# EAGLE design t-maze-shield (EAGLE 6.2)
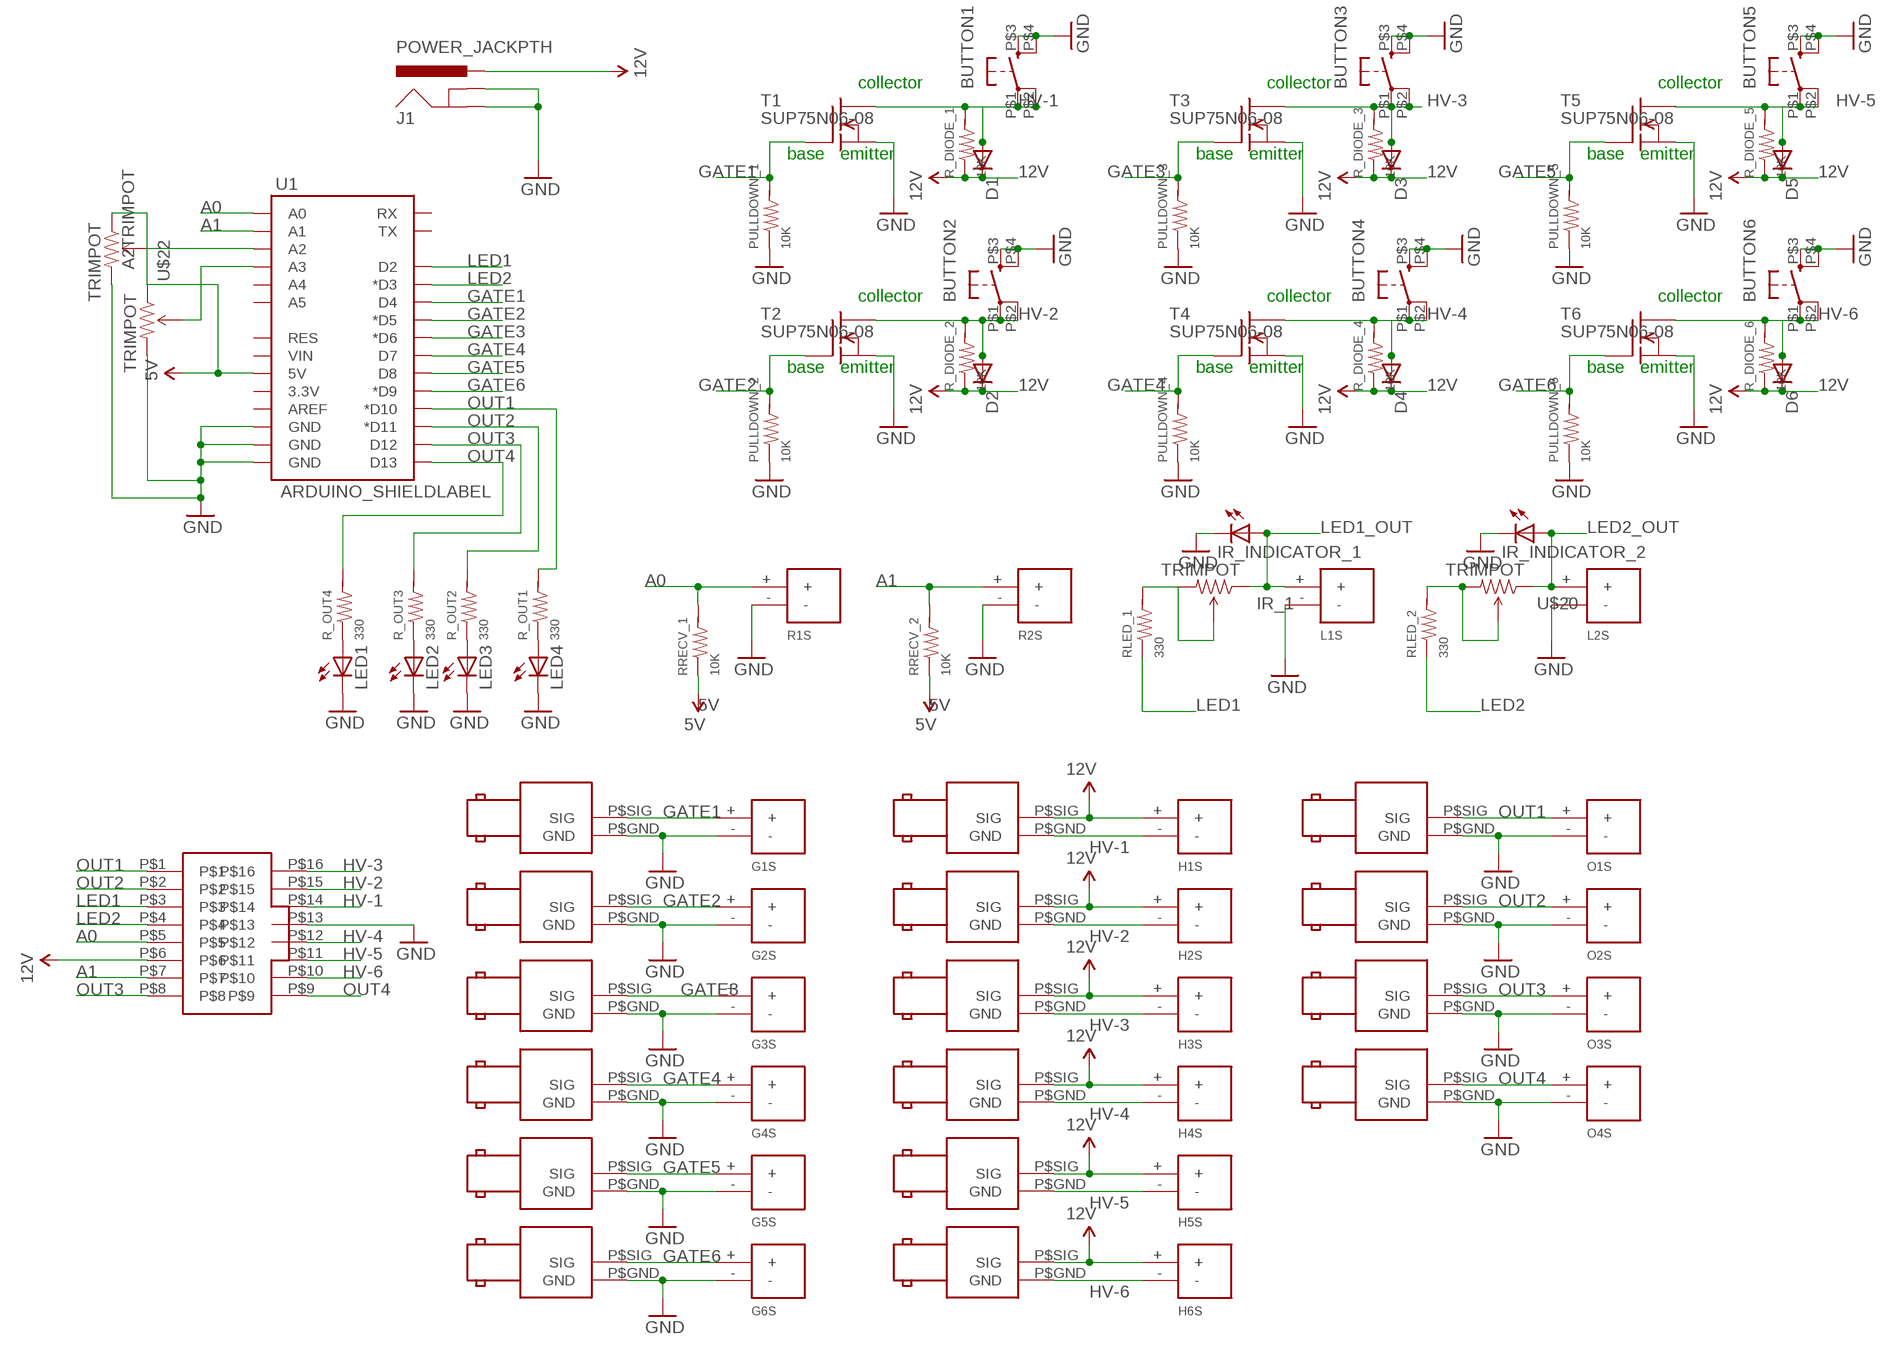
[diagram p0: schematic, sheet 1]

## Parts
A2TRIMPOT  TRIMPOT  [3362U-2]
BUTTON1  TAC_SWITCHKSA_SEALED  [KSA_SEALED_TAC_SWITCH]
BUTTON2  TAC_SWITCHKSA_SEALED  [KSA_SEALED_TAC_SWITCH]
BUTTON3  TAC_SWITCHKSA_SEALED  [KSA_SEALED_TAC_SWITCH]
BUTTON4  TAC_SWITCHKSA_SEALED  [KSA_SEALED_TAC_SWITCH]
BUTTON5  TAC_SWITCHKSA_SEALED  [KSA_SEALED_TAC_SWITCH]
BUTTON6  TAC_SWITCHKSA_SEALED  [KSA_SEALED_TAC_SWITCH]
D1  DIODE1N4148  [DIODE-1N4148]
D2  DIODE1N4148  [DIODE-1N4148]
D3  DIODE1N4148  [DIODE-1N4148]
D4  DIODE1N4148  [DIODE-1N4148]
D5  DIODE1N4148  [DIODE-1N4148]
D6  DIODE1N4148  [DIODE-1N4148]
G1S  SCREW_TERM_2  [SCREW_TERM]
G2S  SCREW_TERM_2  [SCREW_TERM]
G3S  SCREW_TERM_2  [SCREW_TERM]
G4S  SCREW_TERM_2  [SCREW_TERM]
G5S  SCREW_TERM_2  [SCREW_TERM]
G6S  SCREW_TERM_2  [SCREW_TERM]
GATE1  BNC_RIGHT_ANGLE  [BNC_RIGHT_ANGLE]
GATE2  BNC_RIGHT_ANGLE  [BNC_RIGHT_ANGLE]
GATE3  BNC_RIGHT_ANGLE  [BNC_RIGHT_ANGLE]
GATE4  BNC_RIGHT_ANGLE  [BNC_RIGHT_ANGLE]
GATE5  BNC_RIGHT_ANGLE  [BNC_RIGHT_ANGLE]
GATE6  BNC_RIGHT_ANGLE  [BNC_RIGHT_ANGLE]
H1S  SCREW_TERM_2  [SCREW_TERM]
H2S  SCREW_TERM_2  [SCREW_TERM]
H3S  SCREW_TERM_2  [SCREW_TERM]
H4S  SCREW_TERM_2  [SCREW_TERM]
H5S  SCREW_TERM_2  [SCREW_TERM]
H6S  SCREW_TERM_2  [SCREW_TERM]
I/O1  BNC_RIGHT_ANGLE  [BNC_RIGHT_ANGLE]
I/O2  BNC_RIGHT_ANGLE  [BNC_RIGHT_ANGLE]
I/O3  BNC_RIGHT_ANGLE  [BNC_RIGHT_ANGLE]
I/O4  BNC_RIGHT_ANGLE  [BNC_RIGHT_ANGLE]
IDC-16  IDC_16PIN  [IDC_16PIN]
IR_1  TRIMPOT  [3362U-2]
IR_INDICATOR_1  LED5MM  [LED5MM]
IR_INDICATOR_2  LED5MM  [LED5MM]
J1  POWER_JACKPTH  [POWER_JACK_PTH]
L1S  SCREW_TERM_2  [SCREW_TERM]
L2S  SCREW_TERM_2  [SCREW_TERM]
LED1  LED5MM  [LED5MM]
LED2  LED5MM  [LED5MM]
LED3  LED5MM  [LED5MM]
LED4  LED5MM  [LED5MM]
O1S  SCREW_TERM_2  [SCREW_TERM]
O2S  SCREW_TERM_2  [SCREW_TERM]
O3S  SCREW_TERM_2  [SCREW_TERM]
O4S  SCREW_TERM_2  [SCREW_TERM]
OUT1  BNC_RIGHT_ANGLE  [BNC_RIGHT_ANGLE]
OUT2  BNC_RIGHT_ANGLE  [BNC_RIGHT_ANGLE]
OUT3  BNC_RIGHT_ANGLE  [BNC_RIGHT_ANGLE]
OUT4  BNC_RIGHT_ANGLE  [BNC_RIGHT_ANGLE]
OUT5  BNC_RIGHT_ANGLE  [BNC_RIGHT_ANGLE]
OUT6  BNC_RIGHT_ANGLE  [BNC_RIGHT_ANGLE]
PULLDOWN_1  10K  RESISTOR_PTH  [RESISTOR_PTH]
PULLDOWN_2  10K  RESISTOR_PTH  [RESISTOR_PTH]
PULLDOWN_3  10K  RESISTOR_PTH  [RESISTOR_PTH]
PULLDOWN_4  10K  RESISTOR_PTH  [RESISTOR_PTH]
PULLDOWN_5  10K  RESISTOR_PTH  [RESISTOR_PTH]
PULLDOWN_6  10K  RESISTOR_PTH  [RESISTOR_PTH]
R1S  SCREW_TERM_2  [SCREW_TERM]
R2S  SCREW_TERM_2  [SCREW_TERM]
R_DIODE_1  10K  RESISTOR_PTH  [RESISTOR_PTH]
R_DIODE_2  10K  RESISTOR_PTH  [RESISTOR_PTH]
R_DIODE_3  10K  RESISTOR_PTH  [RESISTOR_PTH]
R_DIODE_4  10K  RESISTOR_PTH  [RESISTOR_PTH]
R_DIODE_5  10K  RESISTOR_PTH  [RESISTOR_PTH]
R_DIODE_6  10K  RESISTOR_PTH  [RESISTOR_PTH]
R_OUT1  330  RESISTOR_PTH  [RESISTOR_PTH]
R_OUT2  330  RESISTOR_PTH  [RESISTOR_PTH]
R_OUT3  330  RESISTOR_PTH  [RESISTOR_PTH]
R_OUT4  330  RESISTOR_PTH  [RESISTOR_PTH]
RLED_1  330  RESISTOR_PTH  [RESISTOR_PTH]
RLED_2  330  RESISTOR_PTH  [RESISTOR_PTH]
RRECV_1  10K  RESISTOR_PTH  [RESISTOR_PTH]
RRECV_2  10K  RESISTOR_PTH  [RESISTOR_PTH]
T1  SUP75N06-08  [TO220]
T2  SUP75N06-08  [TO220]
T3  SUP75N06-08  [TO220]
T4  SUP75N06-08  [TO220]
T5  SUP75N06-08  [TO220]
T6  SUP75N06-08  [TO220]
U1  ARDUINO_SHIELDLABEL  [DUEMILANOVE_SHIELD]
U$20  TRIMPOT  [3362U-2]
U$22  TRIMPOT  [3362U-2]

## Nets
5V: A2TRIMPOT.1(CCW) RRECV_1.P$1 RRECV_2.P$1 U1.5V U$22.1(CCW)
12V: D1.C D2.C D3.C D4.C D5.C D6.C H1S.+ H2S.+ H3S.+ H4S.+ H5S.+ H6S.+ IDC-16.P$6 J1.PWR OUT1.P$SIG(SIG) OUT2.P$SIG(SIG) OUT3.P$SIG(SIG) OUT4.P$SIG(SIG) OUT5.P$SIG(SIG) OUT6.P$SIG(SIG) R_DIODE_1.P$1 R_DIODE_2.P$1 R_DIODE_3.P$1 R_DIODE_4.P$1 R_DIODE_5.P$1 R_DIODE_6.P$1
A0: IDC-16.P$5 R1S.+ RRECV_1.P$2 U1.A0
A1: IDC-16.P$7 R2S.+ RRECV_2.P$2 U1.A1
A3TRIMPOT: U1.A3 U$22.2(WIPER)
GATE1: G1S.+ GATE1.P$SIG(SIG) PULLDOWN_1.P$2 T1.1(G) U1.D4
GATE2: G2S.+ GATE2.P$SIG(SIG) PULLDOWN_2.P$2 T2.1(G) U1.D5(*D5)
GATE3: G3S.+ GATE3.P$SIG(SIG) PULLDOWN_3.P$2 T3.1(G) U1.D6(*D6)
GATE4: G4S.+ GATE4.P$SIG(SIG) PULLDOWN_4.P$2 T4.1(G) U1.D7
GATE5: G5S.+ GATE5.P$SIG(SIG) PULLDOWN_5.P$2 T5.1(G) U1.D8
GATE6: G6S.+ GATE6.P$SIG(SIG) PULLDOWN_6.P$2 T6.1(G) U1.D9(*D9)
GND: A2TRIMPOT.3(CW) BUTTON1.P$3 BUTTON1.P$4 BUTTON2.P$3 BUTTON2.P$4 BUTTON3.P$3 BUTTON3.P$4 BUTTON4.P$3 BUTTON4.P$4 BUTTON5.P$3 BUTTON5.P$4 BUTTON6.P$3 BUTTON6.P$4 G1S.- G2S.- G3S.- G4S.- G5S.- G6S.- GATE1.P$GND(GND) GATE2.P$GND(GND) GATE3.P$GND(GND) GATE4.P$GND(GND) GATE5.P$GND(GND) GATE6.P$GND(GND) I/O1.P$GND(GND) I/O2.P$GND(GND) I/O3.P$GND(GND) I/O4.P$GND(GND) IDC-16.P$13 IR_INDICATOR_1.K(C) IR_INDICATOR_2.K(C) J1.GND J1.GNDBREAK L1S.- L2S.- LED1.K(C) LED2.K(C) LED3.K(C) LED4.K(C) O1S.- O2S.- O3S.- O4S.- PULLDOWN_1.P$1 PULLDOWN_2.P$1 PULLDOWN_3.P$1 PULLDOWN_4.P$1 PULLDOWN_5.P$1 PULLDOWN_6.P$1 R1S.- R2S.- T1.3(S) T2.3(S) T3.3(S) T4.3(S) T5.3(S) T6.3(S) U1.GND@0(GND) U1.GND@1(GND) U1.GND@2(GND) U$22.3(CW)
HV-1: BUTTON1.P$1 BUTTON1.P$2 D1.A H1S.- IDC-16.P$14 OUT1.P$GND(GND) R_DIODE_1.P$2 T1.2(D)
HV-2: BUTTON2.P$1 BUTTON2.P$2 D2.A H2S.- IDC-16.P$15 OUT2.P$GND(GND) R_DIODE_2.P$2 T2.2(D)
HV-3: BUTTON3.P$1 BUTTON3.P$2 D3.A H3S.- IDC-16.P$16 OUT3.P$GND(GND) R_DIODE_3.P$2 T3.2(D)
HV-4: BUTTON4.P$1 BUTTON4.P$2 D4.A H4S.- IDC-16.P$12 OUT4.P$GND(GND) R_DIODE_4.P$2 T4.2(D)
HV-5: BUTTON5.P$1 BUTTON5.P$2 D5.A H5S.- IDC-16.P$11 OUT5.P$GND(GND) R_DIODE_5.P$2 T5.2(D)
HV-6: BUTTON6.P$1 BUTTON6.P$2 D6.A H6S.- IDC-16.P$10 OUT6.P$GND(GND) R_DIODE_6.P$2 T6.2(D)
IR_2: RLED_2.P$2 U$20.2(WIPER) U$20.3(CW)
LED1: IDC-16.P$3 RLED_1.P$1 U1.D2
LED1_OUT: IR_1.1(CCW) IR_INDICATOR_1.A L1S.+
LED2: IDC-16.P$4 RLED_2.P$1 U1.D3(*D3)
LED2_OUT: IR_INDICATOR_2.A L2S.+ U$20.1(CCW)
N$2: LED4.A R_OUT1.P$1
N$3: LED3.A R_OUT2.P$1
N$4: IR_1.2(WIPER) IR_1.3(CW) RLED_1.P$2
N$5: LED2.A R_OUT3.P$1
N$6: LED1.A R_OUT4.P$1
N$9: A2TRIMPOT.2(WIPER) U1.A2
OUT1: I/O1.P$SIG(SIG) IDC-16.P$1 O1S.+ R_OUT1.P$2 U1.D10(*D10)
OUT2: I/O2.P$SIG(SIG) IDC-16.P$2 O2S.+ R_OUT2.P$2 U1.D11(*D11)
OUT3: I/O3.P$SIG(SIG) IDC-16.P$8 O3S.+ R_OUT3.P$2 U1.D12
OUT4: I/O4.P$SIG(SIG) IDC-16.P$9 O4S.+ R_OUT4.P$2 U1.D13
Unconnected: U1.3.3V U1.A4 U1.A5 U1.AREF U1.RES U1.RX U1.TX U1.VIN

## Notes on the sheet
- collector | collector | collector
- base | emitter | base | emitter | base | emitter
- collector | collector | collector
- base | emitter | base | emitter | base | emitter

## Library data of the parts
A2TRIMPOT IR_1 U$20 U$22 = sparkfun:TRIMPOT
BUTTON1-BUTTON6 = sparkfun:TAC_SWITCH: Momentary Switch Button commonly used for reset or general input. Spark Fun Electronics SKU : COM-00097
D1-D6 = sparkfun:DIODE: Diode These are standard reverse protection diodes and small signal diodes. SMA package can handle up to about 1A. SOD-323 can handle about 200mA. What the SOD-323 package when ordering, there are some mfgs out there that are 5-pin packages.
G1S G2S G3S G4S G5S G6S H1S H2S H3S H4S H5S H6S L1S L2S O1S O2S O3S O4S R1S R2S = josh:SCREW_TERM_2
GATE1-GATE6 I/O1-I/O4 OUT1-OUT6 = josh:BNC_RIGHT_ANGLE
IDC-16 = josh:IDC_16PIN
IR_INDICATOR_1 IR_INDICATOR_2 LED1-LED4 = sparkfun:LED: LEDs Standard schematic elements and footprints for 5mm, 3mm, 1206, and 0603 sized LEDs. 5mm - Spark Fun Electronics SKU : COM-00529 (and others)
J1 = sparkfun:POWER_JACK: Power Jack This is the standard 5.5mm barrel jack for power. The PTH is the most common, proven, reliable, footprint. All others are experimental. The Slot footprint only works if the mill layer is transmitted to the PCB fab house so be warned. Spark Fun Electronics SKU : PRT-00119. Mating wall wart : TOL-00298 (and others)
PULLDOWN_1-PULLDOWN_6 R_DIODE_1-R_DIODE_6 R_OUT1-R_OUT4 RLED_1 RLED_2 RRECV_1 RRECV_2 = josh:RESISTOR_PTH
T1-T6 = transistor-fet:SUP75N06-08: N-Channel Enhancement MOSFET 60V; 75A; 0,008Ohm
U1 = sparkfun:ARDUINO_SHIELD

## Board
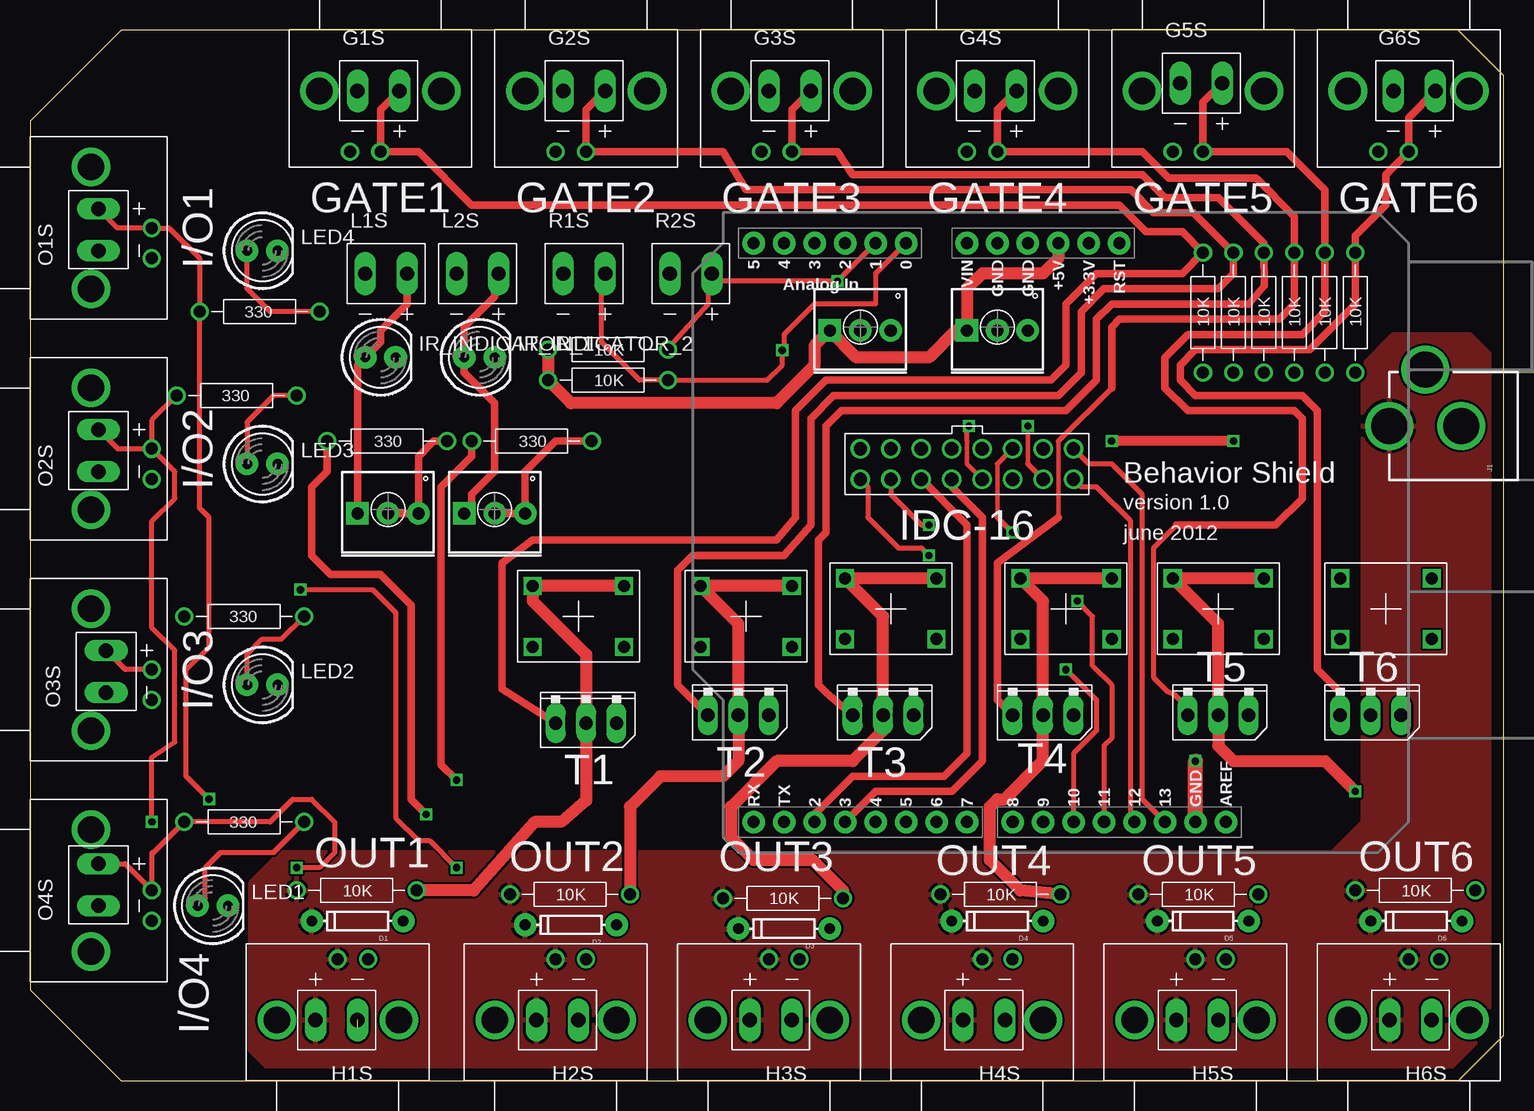
[diagram p1: board, top side]
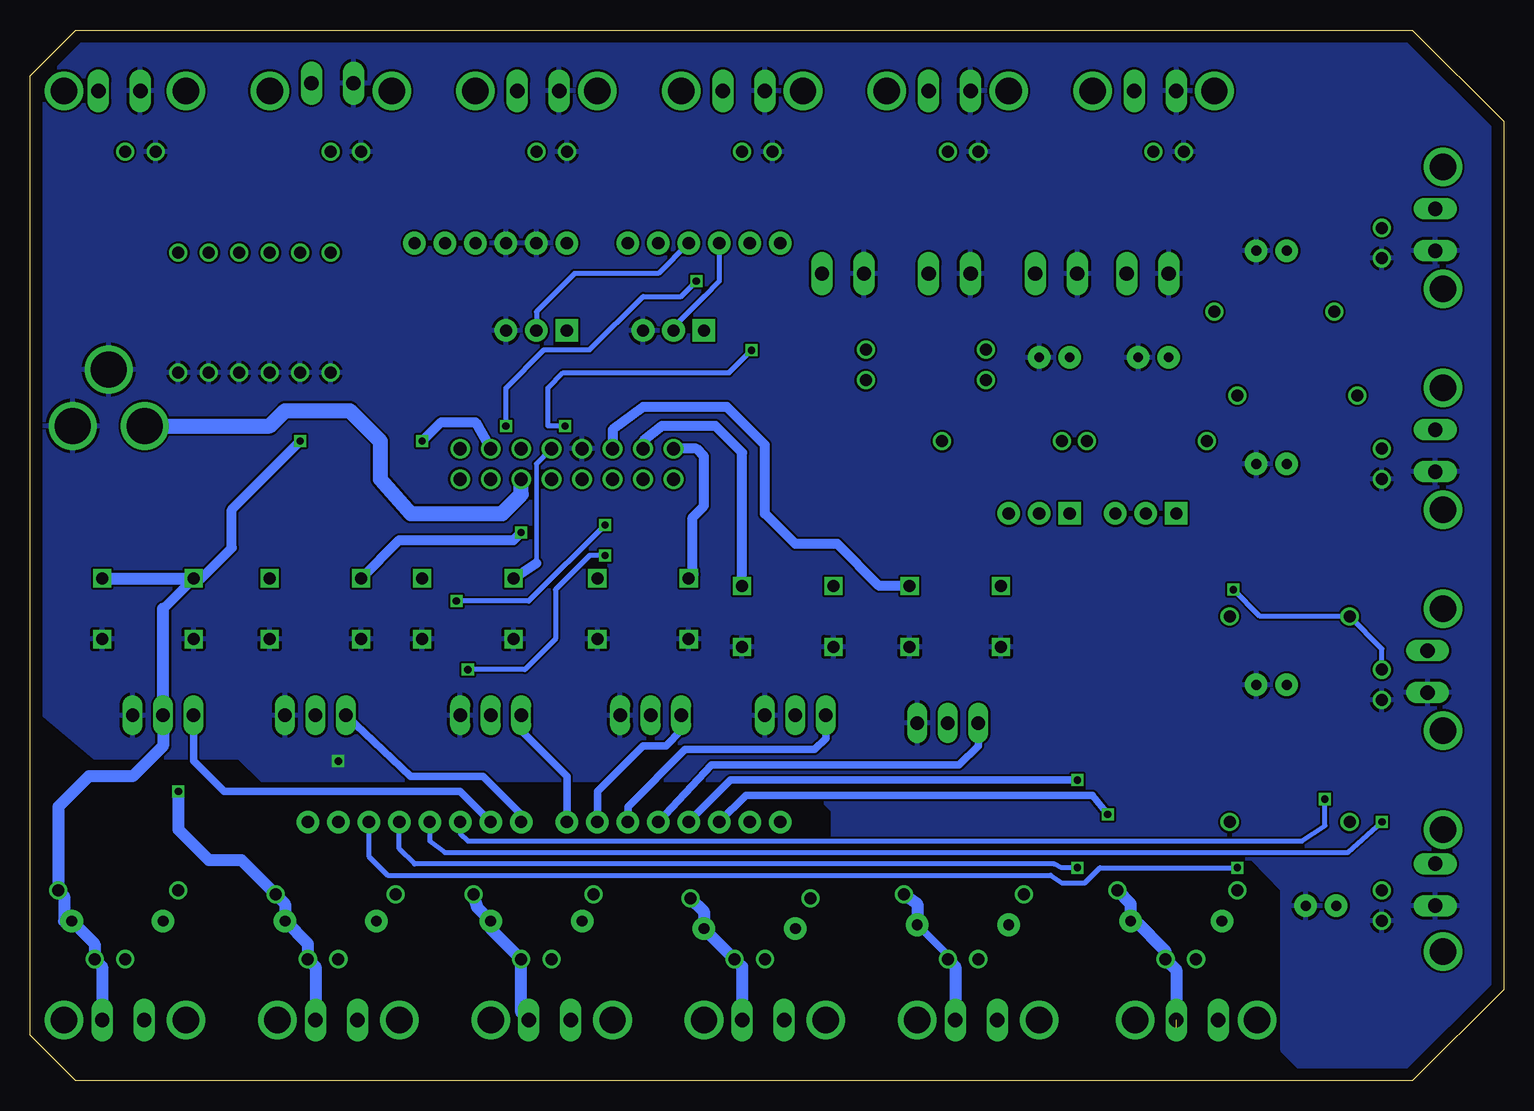
[diagram p2: board, bottom side, seen from below]

Size 122.86 x 87.62 mm. Coordinates in mm from the lower left corner, seen from the top.
Outline: 0,80 0,7.62 7.62,0 119.05,0 122.86,3.81 122.86,83.81 119.05,87.62 7.62,87.62 0,80
Copper layers (1*16): Top 0.035mm / dielectric 1.5mm / Bottom 0.035mm
Design rules: minimum track width 10mil, minimum drill 20mil, track to track 7mil, track to pad 7mil, pad to pad 7mil, via to via 7mil, smd to smd 7mil, copper to edge 40mil, drill to drill 10mil, minimum pad ring 10mil, minimum via ring 8mil, stop-mask expansion 4mil, vias tented up to drill 0mil, thermal gap 10mil

### Footprints (pad centres in the part's own frame; a part is rotated, then mirrored left to right if it is on the bottom)
3362U-2 = drill 1.016 pad 1.88 square: 1 -2.54,-0.305 | drill 1.016 pad 1.88: 2 0,-0.305; 3 2.54,-0.305
KSA_SEALED_TAC_SWITCH = drill 1 square: P$1 -3.81,2.54; P$2 3.81,2.54; P$3 -3.81,-2.54; P$4 3.81,-2.54
DIODE-1N4148 = drill 0.9 pad 1.88: A -3.81,0; C 3.81,0
SCREW_TERM = drill 1.2 long: + 3.5,0; - 0,0
BNC_RIGHT_ANGLE = drill 2.2: P$1 0,0; P$2 10.16,0 | drill 1: P$GND 2.54,-5.08; P$SIG 5.08,-5.08
IDC_16PIN = drill 1.092: P$1 0,0; P$2 2.54,0; P$3 5.08,0; P$4 7.62,0; P$5 10.16,0; P$6 12.7,0; P$7 15.24,0; P$8 17.78,0; P$9 17.78,2.54; P$10 15.24,2.54; P$11 12.7,2.54; P$12 10.16,2.54; P$13 7.62,2.54; P$14 5.08,2.54; P$15 2.54,2.54; P$16 0,2.54
LED5MM = drill 0.813 pad 1.88: A -1.27,0; K 1.27,0
POWER_JACK_PTH = drill 2.997: GND 0,7.7; GNDBREAK 4.7,10.7; PWR 0,13.7
RESISTOR_PTH = drill 1: P$1 0,0; P$2 10,0
TO220 = drill 1.118 long: 1 -2.54,-6.35; 2 0,-6.35; 3 2.54,-6.35
DUEMILANOVE_SHIELD = drill 1.016 pad 1.88: 3.3V 50.8,26.67; 5V 50.8,29.21; A0 50.8,41.91; A1 50.8,44.45; A2 50.8,46.99; A3 50.8,49.53; A4 50.8,52.07; A5 50.8,54.61; AREF 2.54,15.24; D2 2.54,49.53; D3 2.54,46.99; D4 2.54,44.45; D5 2.54,41.91; D6 2.54,39.37; D7 2.54,36.83; D8 2.54,33.02; D9 2.54,30.48; D10 2.54,27.94; D11 2.54,25.4; D12 2.54,22.86; D13 2.54,20.32; GND@0 50.8,31.75; GND@1 50.8,34.29; GND@2 2.54,17.78; RES 50.8,24.13; RX 2.54,54.61; TX 2.54,52.07; VIN 50.8,36.83

### Placement (x,y rotation side)
A2TRIMPOT  80.64,62.87 0 top
BUTTON1  45.72,38.73 0 top
BUTTON2  59.69,38.73 0 top
BUTTON3  71.75,39.37 0 top
BUTTON4  86.36,39.37 0 top
BUTTON5  99.06,39.37 0 top
BUTTON6  113.03,39.37 0 top
D1  27.3,13.34 180 top
D2  45.09,13.02 180 top
D3  62.87,12.7 180 top
D4  80.64,13.34 180 top
D5  97.79,13.34 180 top
D6  115.57,13.34 180 top
G1S  27.3,82.55 0 top
G2S  44.45,82.55 0 top
G3S  61.59,82.55 0 top
G4S  78.74,82.55 0 top
G5S  95.89,83.19 0 top
G6S  113.67,82.55 0 top
GATE1  24.13,82.55 0 top
GATE2  41.27,82.55 0 top
GATE3  58.42,82.55 0 top
GATE4  75.56,82.55 0 top
GATE5  92.71,82.55 0 top
GATE6  109.86,82.55 0 top
H1S  27.3,5.08 180 top
H2S  45.72,5.08 180 top
H3S  63.5,5.08 180 top
H4S  81.28,5.08 180 top
H5S  99.06,5.08 180 top
H6S  116.84,5.08 180 top
I/O1  5.08,66.04 90 top
I/O2  5.08,47.62 90 top
I/O3  5.08,29.21 90 top
I/O4  5.08,10.79 90 top
IDC-16  69.22,50.16 0 top
IR_1  29.84,47.62 0 top
IR_INDICATOR_1  29.21,60.33 0 top
IR_INDICATOR_2  37.47,60.33 0 top
J1  127,54.61 90 top
L1S  27.94,67.31 0 top
L2S  35.56,67.31 0 top
LED1  15.24,14.61 0 top
LED2  19.37,33.02 0 top
LED3  19.37,51.44 0 top
LED4  19.37,69.22 0 top
O1S  5.71,69.22 90 top
O2S  5.71,50.8 90 top
O3S  6.35,32.38 90 top
O4S  5.71,14.61 90 top
OUT1  30.73,5.08 180 top
OUT2  48.9,5.08 180 top
OUT3  66.67,5.08 180 top
OUT4  84.45,5.08 180 top
OUT5  102.23,5.08 180 top
OUT6  120.02,5.08 180 top
PULLDOWN_1  97.79,59.05 90 top
PULLDOWN_2  100.33,59.05 90 top
PULLDOWN_3  102.87,59.05 90 top
PULLDOWN_4  105.41,59.05 90 top
PULLDOWN_5  107.95,59.05 90 top
PULLDOWN_6  110.49,59.05 90 top
R1S  44.45,67.31 0 top
R2S  53.34,67.31 0 top
R_DIODE_1  22.23,15.88 0 top
R_DIODE_2  40.01,15.56 0 top
R_DIODE_3  57.78,15.24 0 top
R_DIODE_4  75.88,15.56 0 top
R_DIODE_5  92.39,15.56 0 top
R_DIODE_6  110.49,15.88 0 top
R_OUT1  24.13,64.14 180 top
R_OUT2  22.23,57.15 180 top
R_OUT3  22.86,38.73 180 top
R_OUT4  22.86,21.59 180 top
RLED_1  24.77,53.34 0 top
RLED_2  36.83,53.34 0 top
RRECV_1  43.18,58.42 0 top
RRECV_2  43.18,60.96 0 top
T1  46.35,36.2 0 top
T2  59.05,36.83 0 top
T3  71.12,36.83 0 top
T4  84.45,36.83 0 top
T5  99.06,36.83 0 top
T6  111.76,36.83 0 top
U1  114.94,19.05 90 top
U$20  38.73,47.62 0 top
U$22  69.22,62.87 0 top

### Tracks (layer width: path | path; a pad name or v marks a point on that pad's centre or on a via)
5V
  Top 0.406: 77.8,62.23 A2TRIMPOT.1
  Top 1.016: U1.5V 85.72,68.58 84.45,67.31 79.38,67.31 78.11,66.04 A2TRIMPOT.1 77.17,62.56 74.93,60.33 68.91,60.33 U$22.1 65.41,61.29 65.41,59.69 62.23,56.52 45.09,56.52 RRECV_1.P$1 RRECV_2.P$1
12V
  Top 0.406: J1.PWR 113.98,54.61
  Bottom 1.27: J1.PWR 102.87,54.61 101.6,55.88 96.2,55.88 93.66,53.34 93.66,50.16 91.12,47.31 83.5,47.31 81.92,48.9 IDC-16.P$6
  pour Top: 20.95,19.05 108.58,19.05 111.12,21.59 111.12,59.69 113.67,62.23 120.02,62.23 122.56,59.69 122.56,2.54 120.02,0 20.95,0 18.41,2.54 18.41,16.51
A0  (via drill 0.6)
  Top 0.356: IDC-16.P$5 78.11,51.44 78.11,53.34
  Top 0.406: U1.A0 70.48,67.31 70.48,64.77 65.41,64.77 62.87,62.23 62.87,60.96 v62.71,60.92 62.71,59.69 61.44,58.42 RRECV_1.P$2 50.8,58.42 47.62,61.59 47.62,68.58 47.95,67.64 R1S.+ | 78.11,53.34 78.11,54.61 v78.27,54.61
  Bottom 0.406: v78.27,54.61 79.69,54.61 79.69,57.78 78.42,59.05 64.57,59.05 v62.71,60.92
A1  (via drill 0.6)
  Top 0.356: 83.19,51.44 v83.19,54.61
  Top 0.406: U1.A1 v67.31,66.67 57.48,66.67 R2S.+ 56.52,67.62 56.52,64.77 53.18,61.12 RRECV_2.P$2 | IDC-16.P$7 83.19,51.44
  Bottom 0.406: v83.19,54.61 83.19,57.78 80.01,60.96 76.2,60.96 71.75,65.41 68.58,65.41 v67.31,66.67
A3TRIMPOT
  Bottom 0.406: U1.A3 65.41,66.67 66.67,65.41 69.22,62.87 U$22.2
GATE1
  Top 0.406: 97.63,69.22 PULLDOWN_1.P$2
  Top 0.61: G1S.+ 29.21,80.95 GATE1.P$SIG 32.38,77.47 36.83,73.03 90.81,73.03 93.03,70.8 96.04,70.8 PULLDOWN_1.P$2 96.05,67.31 88.9,67.31 86.36,64.77 86.36,59.69 85.09,58.42 66.36,58.42 63.82,55.88 63.82,46.99 62.23,45.09 41.91,45.09 39.37,43.18 39.37,32.7 T1.1
  Bottom 0.61: U1.D4 66.04,26.35 45.4,26.35 43.81,27.94 T1.1
GATE2
  Top 0.61: G2S.+ 46.35,80.95 GATE2.P$SIG 57.78,77.47 59.69,74.3 91.76,74.3 93.66,72.39 97,72.39 PULLDOWN_2.P$2 100.33,67.31 99.06,66.04 89.53,66.04 87.63,64.14 87.63,59.05 85.72,57.15 66.99,57.15 65.09,55.24 65.09,46.35 62.87,43.81 55.24,43.81 53.98,42.55 53.98,33.02 T2.1
  Bottom 0.61: U1.D5 73.03,22.86 68.26,27.62 57.47,27.62 56.52,28.57 T2.1
GATE3
  Top 0.61: G3S.+ 63.5,80.95 GATE3.P$SIG 67.31,77.47 68.58,75.56 92.71,75.56 94.61,73.66 99.06,73.66 102.87,69.85 PULLDOWN_3.P$2 102.9,66.29 101.6,64.77 90.17,64.77 88.9,63.5 88.9,58.42 86.36,55.88 67.63,55.88 66.36,54.61 66.36,45.72 65.72,45.09 65.72,33.02 66.36,32.38 T3.1
  Bottom 0.61: U1.D6 75.56,24.13 71.75,27.94 69.85,27.94 68.58,29.21 T3.1
GATE4
  Top 0.356: 85.72,53.34 85.72,46.99
  Top 0.406: 90.17,57.78 85.72,53.34
  Top 0.61: G4S.+ 80.64,80.95 GATE4.P$SIG 92.71,77.47 94.93,75.25 102.23,75.25 105.41,72.07 PULLDOWN_4.P$2 105.41,64.77 104.14,63.5 90.81,63.5 90.17,62.87 90.17,57.78 | 85.72,46.99 80.64,43.18 80.64,31.75 T4.1
  Bottom 0.61: U1.D7 78.11,25.4 79.38,26.67 81.92,29.21 T4.1
GATE5
  Top 0.406: 95.57,46.35 93.66,44.45 93.66,33.66 94.82,32.47 95.35,32.29 96.52,31.11 T5.1
  Top 0.61: G5S.+ 97.79,81.59 GATE5.P$SIG 104.78,77.47 107.95,74.3 PULLDOWN_5.P$2 107.95,64.14 106.05,62.23 96.52,62.23 94.61,60.33 94.61,57.78 96.52,55.88 105.41,55.88 106.05,55.24 106.05,48.58 103.82,46.35 95.57,46.35
  Bottom 0.61: U1.D8 81.92,22.23 85.09,25.4 91.12,25.4 T5.1
GATE6
  Top 0.406: 109.22,29.84 T6.1
  Top 0.61: G6S.+ 114.94,80.32 GATE6.P$SIG 113.03,75.56 113.03,73.03 110.49,70.48 PULLDOWN_6.P$2 110.49,64.77 106.68,60.96 97.16,60.96 95.89,59.69 95.89,58.42 97.16,57.15 106.05,57.15 107.31,55.88 107.31,34.29 109.22,32.38 T6.1
  Bottom 0.61: U1.D9 87,24.13 106.68,24.13 109.22,26.67 T6.1
GND  (via drill 0.6)
  Top 1.27: U1.GND@2 v97.16,26.67
  pour Bottom: 123.19,31.75 123.19,82.55 118.11,87.63 7.62,87.63 0,80.01 0,7.62 7.62,0 15.88,0 18.41,2.54 18.41,15.96 20.87,18.5 55.88,19.68 55.88,22.54 58.42,25.08 103.5,25.08 105.41,26.99 117.47,26.99
HV-1  (1 unrouted)
  Top 1.016: R_DIODE_1.P$2 36.99,15.88 42.07,21.59 44.31,21.61 46.35,23.39 T1.2 46.35,35.56 41.91,40.01 BUTTON1.P$1 BUTTON1.P$2
  Bottom 0.813: BUTTON1.P$2 52.07,41.27 55.56,44.77 59.05,44.77 61.59,47.31 61.59,53.02 64.77,56.2 71.75,56.2 74.3,54.29 IDC-16.P$14
  Bottom 1.016: R_DIODE_1.P$2 31.11,14.77 D1.A 30.73,13.34 28.19,10.79 OUT1.P$GND 27.3,9.27 27.3,4.45
HV-2
  Top 1.016: R_DIODE_2.P$2 50.01,22.86 52.55,25.4 57.78,25.4 59.05,26.67 T2.2 59.05,38.1 BUTTON2.P$1 BUTTON2.P$2
  Bottom 0.61: OUT2.P$GND 46.35,10.48 D2.A
  Bottom 0.813: BUTTON2.P$2 63.5,52.39 65.72,54.61 70.17,54.61 71.75,53.34 IDC-16.P$15
  Bottom 1.016: R_DIODE_2.P$2 48.9,14.77 D2.A | OUT2.P$GND 45.72,9.53 H2S.-
HV-3
  Top 0.406: 67.78,15.88 R_DIODE_3.P$2
  Top 1.016: 67.78,15.88 65.25,18.41 60.33,18.41 58.42,20.32 58.42,22.86 62.23,26.67 68.58,26.67 71.12,29.21 T3.2 71.12,38.73 BUTTON3.P$1 BUTTON3.P$2
  Bottom 0.813: 67.63,42.23 67.63,46.99 66.67,47.94 66.67,52.07 67.31,52.7 IDC-16.P$16
  Bottom 1.016: R_DIODE_3.P$2 66.67,14.13 D3.A OUT3.P$GND 63.5,9.53 H3S.- | BUTTON3.P$1 67.63,42.23
HV-4
  Top 1.016: R_DIODE_4.P$2 82.55,15.88 80.01,18.41 80.01,22.86 80.64,23.5 81.28,23.5 84.45,26.67 T4.2 84.45,40.01 BUTTON4.P$1 BUTTON4.P$2
  Bottom 0.356: 80.64,43.18 80.64,51.44
  Bottom 0.406: 84.45,12.7 D4.A | 80.64,51.44 IDC-16.P$12
  Bottom 0.813: BUTTON4.P$1 80.64,43.18
  Bottom 1.016: H4S.- 81.92,5.71 OUT4.P$GND 84.45,12.7 | D4.A 85.56,14.45 R_DIODE_4.P$2
HV-5  (via drill 0.6)
  Top 0.356: 80.64,46.99 80.64,51.44
  Top 0.406: v81.92,45.72 80.64,46.99 | 80.64,51.44 IDC-16.P$11
  Top 1.016: v110.49,24.13 107.95,26.67 100.33,26.67 99.06,27.94 T5.2 99.06,38.1 BUTTON5.P$1 BUTTON5.P$2
  Bottom 0.813: BUTTON5.P$1 92.08,45.09 82.55,45.09 v81.92,45.72
  Bottom 1.016: v110.49,24.13 110.49,20.95 107.95,18.41 105.25,18.41 R_DIODE_5.P$2 101.6,14.77 D5.A 99.69,11.43 OUT5.P$GND 99.06,9.53 H5S.-
HV-6  (via drill 0.6)
  Top 0.813: v100.33,53.34 v90.17,53.34
  Bottom 0.813: 111.76,39.37 BUTTON6.P$1 108.58,41.91 106.05,44.45 106.05,47.62 v100.33,53.34 | v90.17,53.34 88.58,54.93 85.72,54.93 IDC-16.P$10
  Bottom 1.016: H6S.- 116.84,9.53 OUT6.P$GND 117.47,11.43 D6.A 120.02,13.34 120.02,15.4 R_DIODE_6.P$2 120.49,22.86 117.95,25.4 114.3,25.4 111.76,27.94 T6.2 111.76,39.37 | BUTTON6.P$2 BUTTON6.P$1
IR_2
  Top 0.61: RLED_2.P$2 43.81,53.34 41.27,50.8 U$20.3 U$20.2
LED1  (via drill 0.6)
  Top 0.406: U1.D2 65.41,22.23
  Top 0.61: 65.41,22.23 68.58,25.4 76.2,25.4 78.11,27.3 78.11,46.35 IDC-16.P$3 | v33.02,22.23 31.75,23.5 31.75,39.69 29.21,42.23 25.08,42.23 23.5,43.81 23.5,49.53 24.77,50.8 RLED_1.P$1
  Bottom 0.61: v33.02,22.23 34.29,23.81 63.18,23.81 U1.D2
LED1_OUT
  Top 0.406: 27.3,46.99 IR_1.1 | IR_INDICATOR_1.A 27.3,59.69
  Top 0.61: IR_INDICATOR_1.A 29.21,61.59 29.21,62.54 30.17,63.5 31.44,64.77 L1S.+ | 27.3,59.69 IR_1.1
LED2  (via drill 0.6)
  Top 0.61: U1.D3 70.48,24.13 76.83,24.13 79.38,26.67 79.38,46.99 76.83,49.53 IDC-16.P$4 | v35.56,25.08 34.29,26.35 34.29,49.53 36.83,52.07 RLED_2.P$1
  Bottom 0.61: v35.56,25.08 64.45,25.08 U1.D3
LED2_OUT
  Top 0.61: U$20.1 36.83,47.95 36.83,48.9 38.73,50.8 38.73,56.52 36.2,59.05 IR_INDICATOR_2.A 36.2,62.87 37.47,64.14 38.73,65.41 38.73,66.98 L2S.+
N$2
  Top 0.406: R_OUT1.P$1 20,64.14 18.1,66.04 LED4.A
N$3
  Top 0.406: R_OUT2.P$1 20.32,57.15 18.1,54.93 LED3.A
N$4
  Top 0.61: IR_1.2 IR_1.3 32.38,52.07 33.66,53.34 RLED_1.P$2
N$5
  Top 0.406: LED2.A 18.1,35.56 19.37,36.83 20.95,36.83 R_OUT3.P$1
N$6
  Top 0.406: LED1.A 14.61,15.24 14.61,17.78 15.88,19.05 20.32,19.05 R_OUT4.P$1
N$9
  Bottom 0.406: U1.A2 70.48,67.31 77.47,67.31 80.64,64.14 A2TRIMPOT.2
OUT1  (via drill 0.6)
  Top 0.406: O1S.+ 7.31,71.12 I/O1.P$SIG 11.59,71.12 14.13,68.58 R_OUT1.P$2 14.13,47.78 14.92,46.99 14.92,36.2 13.02,34.29 13.02,25.4 v14.92,23.5 | IDC-16.P$1 69.85,49.53 69.85,46.99 72.39,44.45 74.3,44.45 v74.93,43.81 | v86.36,34.29 88.9,31.75 88.9,29.21 87,27.3 U1.D10
  Bottom 0.406: U1.D10 87,20.64 86.36,20 16.83,20 14.92,21.27 v14.92,23.5 | v74.93,43.81 76.2,43.81 79.06,40.96 79.06,36.83 81.6,34.29 v86.36,34.29
OUT2  (via drill 0.6)
  Top 0.406: R_OUT2.P$2 10.16,55.09 I/O2.P$SIG | O2S.+ 7.31,52.7 I/O2.P$SIG | IDC-16.P$2 71.75,48.9 74.3,46.35 v74.93,46.35 | U1.D11 89.53,27.94 90.17,28.57 90.17,33.02 88.58,34.61 88.58,38.73 v87.31,40.01 | v10.16,21.59 10.16,26.99 12.06,28.26 12.06,35.88 10.16,37.78 10.16,46.67 12.06,48.58 12.06,50.8 I/O2.P$SIG
  Bottom 0.406: v74.93,46.35 81.28,40.01 v87.31,40.01 | 89.53,20.95 U1.D11 89.53,20 88.27,19.05 13.02,19.05 v10.16,21.59
OUT3  (via drill 0.6)
  Top 0.406: U1.D12 91.76,21.91 91.76,46.67 88.9,49.53 87.63,49.53 IDC-16.P$8 | v22.54,40.96 28.57,40.96 30.48,39.05 30.48,21.91 32.38,20 33.34,20 v35.56,17.78 | I/O3.P$SIG 7.95,34.29 O3S.+
  Bottom 0.406: v22.54,40.96 20.32,38.73 R_OUT3.P$2 10.16,36.03 I/O3.P$SIG | v35.56,17.78 36.83,17.78 37.47,18.1 90.81,18.1 92.08,19.37 U1.D12
OUT4  (via drill 0.6)
  Top 0.406: IDC-16.P$9 88.27,51.44 90.17,51.44 92.71,48.9 92.71,23.5 U1.D13 | O4S.+ 7.93,18.11 I/O4.P$SIG 10.16,19.05 10.32,19.05 R_OUT4.P$2 20,21.59 21.91,23.5 23.5,23.5 25.4,21.59 25.4,19.05 24.13,17.78 v22.23,17.78
  Bottom 0.406: U1.D13 94.61,18.73 93.03,17.14 37.78,17.14 36.83,16.51 34.92,16.51 33.66,17.78 v22.23,17.78 | R_OUT4.P$2 12.7,21.59

### Text on the board
tNames: Behavior Shield | version 1.0 | june 2012